# Altium schematic sheet Temporary.SchDoc
size A3; SheetNumber: 3; SheetTotal: 3
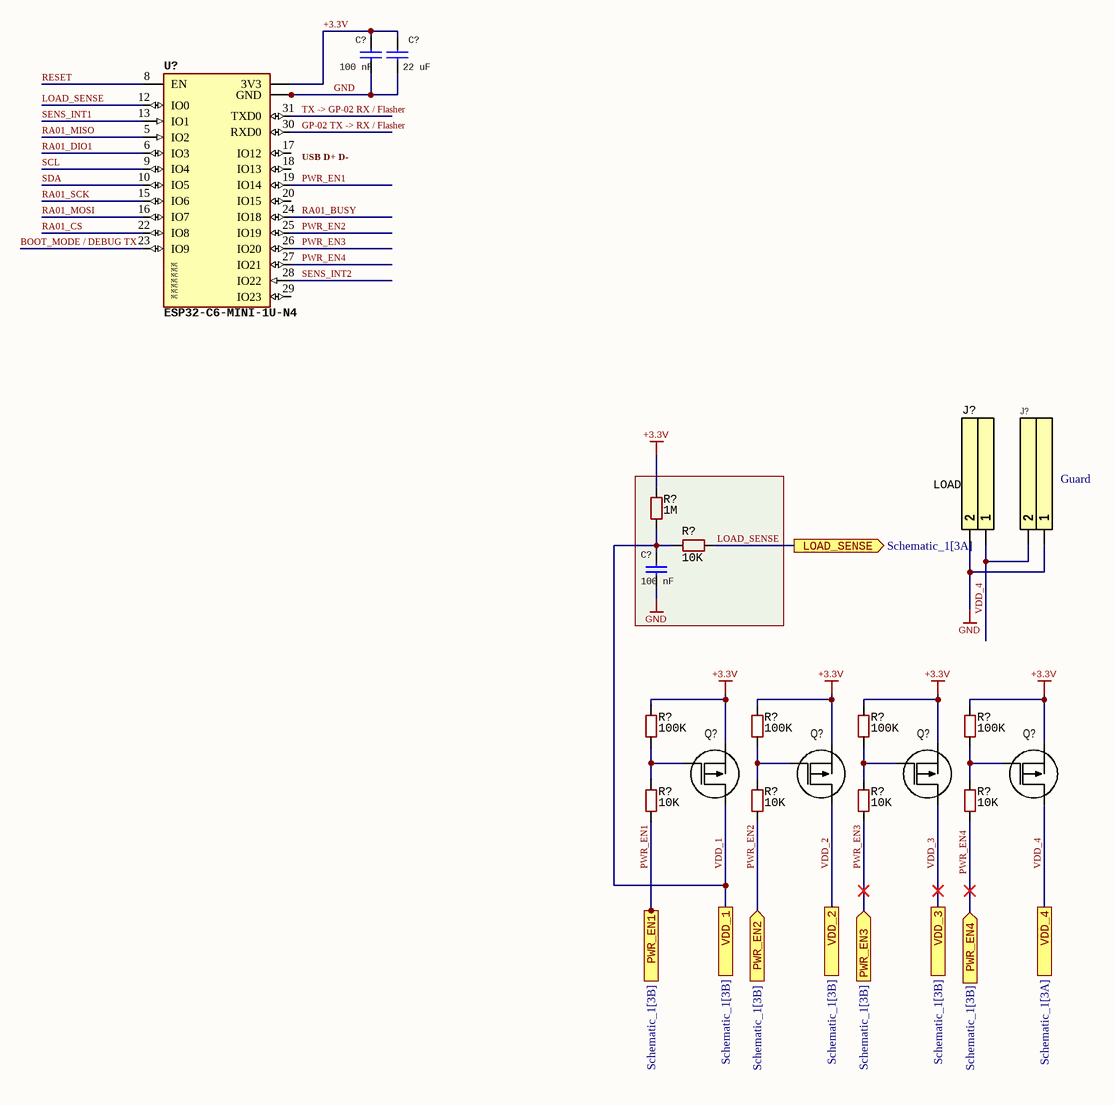
[diagram p0: Temporary.SchDoc]

## Parts
(Parts that share a designator on the sheet are numbered #1, #2 ... from top to bottom, then left to right.)
C?#1  value 100 nF  [0603_CAPASITOR]  (hidden comment: Capasitor)
C?#2  value 22 uF  [0603_CAPASITOR]  (hidden comment: Capasitor)
C?#3  value 100 nF  [0603_CAPASITOR]  (hidden comment: Capacitor)
J?#1  LOAD  [2_wire_terminal]  (no BOM)
J?#2  Decription: Guard  [PLS-2.54mm-2-90deg]  (hidden comment: PLS_2.54mm_x2_90deg)
Q?#1  transistor  [SOT23]  (value not drawn)
Q?#2  transistor  [SOT23]  (value not drawn)
Q?#3  transistor  [SOT23]  (value not drawn)
Q?#4  transistor  [SOT23]  (value not drawn)
R?#1  value 1M  [0603_RESISTOR]  (hidden comment: resistor)
R?#2  value 10K  [0603_RESISTOR]  (hidden comment: resistor)
R?#3  value 100K  [0603_RESISTOR]  (hidden comment: resistor)
R?#4  value 100K  [0603_RESISTOR]  (hidden comment: resistor)
R?#5  value 100K  [0603_RESISTOR]  (hidden comment: resistor)
R?#6  value 100K  [0603_RESISTOR]  (hidden comment: resistor)
R?#7  value 10K  [0603_RESISTOR]  (hidden comment: resistor)
R?#8  value 10K  [0603_RESISTOR]  (hidden comment: resistor)
R?#9  value 10K  [0603_RESISTOR]  (hidden comment: resistor)
R?#10  value 10K  [0603_RESISTOR]  (hidden comment: resistor)
U?  ESP32-C6-MINI-1U-N4  [SMD-53 Espressif Systems (External Antenna)]

## Ports
LOAD_SENSE (out, see Schematic_1[3A]), PWR_EN1 (in, see Schematic_1[3B]), PWR_EN2 (in, see Schematic_1[3B]), PWR_EN3 (in, see Schematic_1[3B]), PWR_EN4 (in, see Schematic_1[3B]), VDD_1 (see Schematic_1[3B]), VDD_2 (see Schematic_1[3B]), VDD_3 (see Schematic_1[3B]), VDD_4 (see Schematic_1[3A])

## Nets
+3.3V: C?#1.2 C?#2.2 Q?#1.3(S) Q?#2.3(S) Q?#3.3(S) Q?#4.3(S) R?#1.2 R?#3.2 R?#4.2 R?#5.2 R?#6.2 U?.3(3V3)
GND: C?#1.1 C?#2.1 C?#3.1 J?#1.2 J?#2.1 U?.1(GND) U?.2(GND) U?.11(GND) U?.14(GND) U?.36(GND) U?.37(GND) U?.38(GND) U?.39(GND) U?.40(GND) U?.41(GND) U?.42(GND) U?.43(GND) U?.44(GND) U?.45(GND) U?.46(GND) U?.47(GND) U?.48(GND) U?.49_1(GND) U?.49_2(GND) U?.49_3(GND) U?.49_4(GND) U?.49_5(GND) U?.49_6(GND) U?.49_7(GND) U?.49_8(GND) U?.49_9(GND) U?.50(GND) U?.51(GND) U?.52(GND) U?.53(GND)
BOOT_MODE / DEBUG TX: U?.23(IO9)
GP-02 TX -> RX / Flasher: U?.30(RXD0)
LOAD_SENSE: R?#2.1 U?.12(IO0) ; port LOAD_SENSE
PWR_EN1: R?#7.1 U?.19(IO14) ; port PWR_EN1
PWR_EN2: R?#8.1 U?.25(IO19) ; port PWR_EN2
PWR_EN3: R?#9.1 U?.26(IO20) ; port PWR_EN3
PWR_EN4: R?#10.1 U?.27(IO21) ; port PWR_EN4
RA01_BUSY: U?.24(IO18)
RA01_CS: U?.22(IO8)
RA01_DIO1: U?.6(IO3)
RA01_MISO: U?.5(IO2)
RA01_MOSI: U?.16(IO7)
RA01_SCK: U?.15(IO6)
RESET: U?.8(EN)
SCL: U?.9(IO4)
SDA: U?.10(IO5)
SENS_INT1: U?.13(IO1)
SENS_INT2: U?.28(IO22)
TX -> GP-02 RX / Flasher: U?.31(TXD0)
VDD_1: C?#3.2 Q?#1.2(D) R?#1.1 R?#2.2 ; port VDD_1
VDD_2: Q?#2.2(D) ; port VDD_2
VDD_3: Q?#3.2(D) ; port VDD_3
VDD_4: J?#1.1 J?#2.2 Q?#4.2(D) ; port VDD_4
NetQ?#1_1: Q?#1.1(G) R?#3.1 R?#7.2
NetQ?#2_1: Q?#2.1(G) R?#4.1 R?#8.2
NetQ?#3_1: Q?#3.1(G) R?#5.1 R?#9.2
NetQ?#4_1: Q?#4.1(G) R?#6.1 R?#10.2

Not connected (* = marked no-connect by the designer): U? 4(NC) 7(NC) 17(IO12) 18(IO13) 20(IO15) 21(NC) 29(IO23) 32(NC) 33(NC) 34(NC) 35(NC)

## Notes on the sheet
- (near U?) USB D+ D-

## Library data of the parts
C?#1 C?#2 = capasitor_smd: TODO delete this / wrong name capaSitor; Voltage: 10V; Tolerance: ±20%; Dielectric: X5R/X7R; Package: 0603
C?#3 = capacitor_smd: Voltage: 6V; Tolerance: ±20%; Dielectric: X5R/X7R; Package: 0603
J?#1 = Wire_2_pads: Simple 2 pads to solder wire without connector
Q?#1-Q?#4 = P-Channel MOS: Package: SOT-23
R?#1 R?#2 R?#7-R?#10 = resistor: Tolerance: ±5%; Power: 0.125W; Package: 0603
R?#3-R?#6 = resistor: Tolerance: ±1%; Power: 0.125W; Package: 0603
U? = ESP32-C6-MINI-1U-N4: 802.15.4, Bluetooth, WiFi 802.11ax, Bluetooth v5.0, ZigbeeÂ® Transceiver Module 2.4GHz; / Antenna (not included): / Hirose W.FL / I-PEX MHF III (MHF3, IPEX3) / Amphenol AMMC; MF: Espressif Systems; MP: ESP32-C6-MINI-1-N4; Package: SMD-53 Espressif Systems; Value: *